# EAGLE design bldcmd_ver1 (EAGLE 8.6.1)

## Sheet 1 of 2
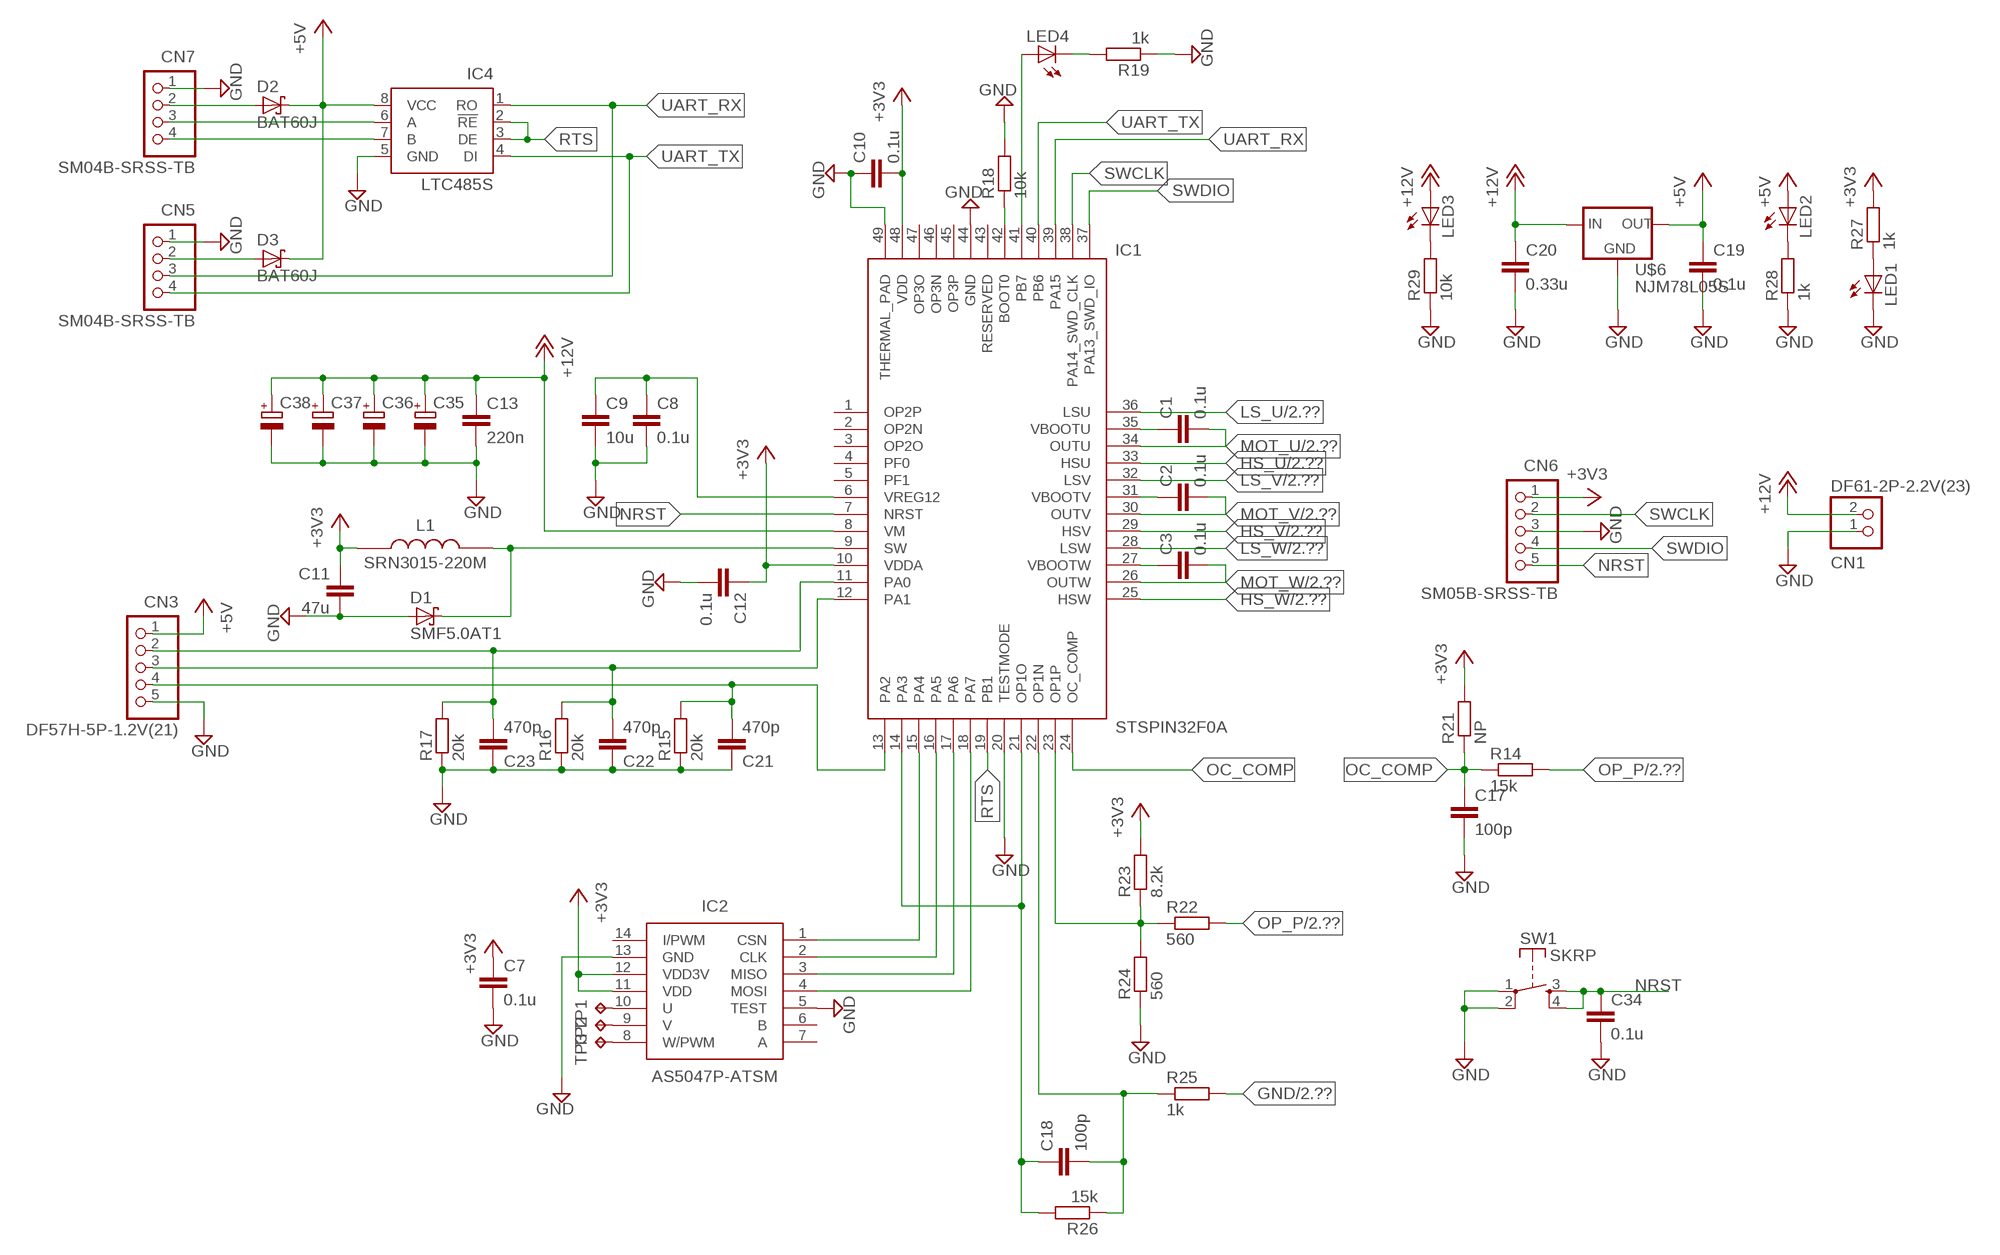
[diagram p0: schematic, sheet 1]

### Parts
C1  0.1u  C-EUC0402  [C0402]
C2  0.1u  C-EUC0402  [C0402]
C3  0.1u  C-EUC0402  [C0402]
C7  0.1u  C-EUC0603K  [C0603K]
C8  0.1u  C-EUC0603K  [C0603K]
C9  10u  C-EUC0805K  [C0805K]
C10  0.1u  C-EUC0603K  [C0603K]
C11  47u  C-EUC1206K  [C1206K]
C12  0.1u  C-EUC0603K  [C0603K]
C13  220n  C-EUC0805K  [C0805K]
C17  100p  C-EUC0402  [C0402]
C18  100p  C-EUC0402  [C0402]
C19  0.1u  C-EUC0603K  [C0603K]
C20  0.33u  C-EUC0805K  [C0805K]
C21  470p  C-EUC0402  [C0402]
C22  470p  C-EUC0402  [C0402]
C23  470p  C-EUC0402  [C0402]
C34  0.1u  C-EUC0603K  [C0603K]
C35  CPOL-EU153CLV-0605  [153CLV-0605]
C36  CPOL-EU153CLV-0605  [153CLV-0605]
C37  CPOL-EU153CLV-0605  [153CLV-0605]
C38  CPOL-EU153CLV-0605  [153CLV-0605]
CN1  DF61-2P-2.2V(23)  [DF61-2P-2.2V]
CN3  DF57H-5P-1.2V(21)  [DF57H-5P-1.2V(21)]
CN5  SM04B-SRSS-TB  [SM04B-SRSS-TB]
CN6  SM05B-SRSS-TB  [SM05B-SRSS-TB]
CN7  SM04B-SRSS-TB  [SM04B-SRSS-TB]
D1  SMF5.0AT1  [SOD123FL]
D2  BAT60J  [SOD323_ST]
D3  BAT60J  [SOD323_ST]
IC1  STSPIN32F0A  [VFQFPN48_7X7X1.0-48L]
IC2  AS5047P-ATSM  [SOP65P640X120-14N]
IC4  LTC485S  [SOIC8]
L1  SRN3015-220M  [SRN3015]
LED1  LEDSML0603  [SML0603]
LED2  LEDSML0603  [SML0603]
LED3  LEDSML0603  [SML0603]
LED4  LEDSML0603  [SML0603]
R14  15k  R-EU_R0402  [R0402]
R15  20k  R-EU_R0402  [R0402]
R16  20k  R-EU_R0402  [R0402]
R17  20k  R-EU_R0402  [R0402]
R18  10k  R-EU_R0402  [R0402]
R19  1k  R-EU_R0603  [R0603]
R21  NP  R-EU_R0402  [R0402]
R22  560  R-EU_R0402  [R0402]
R23  8.2k  R-EU_R0402  [R0402]
R24  560  R-EU_R0402  [R0402]
R25  1k  R-EU_R0402  [R0402]
R26  15k  R-EU_R0402  [R0402]
R27  1k  R-EU_R0603  [R0603]
R28  1k  R-EU_R0603  [R0603]
R29  10k  R-EU_R0603  [R0603]
SW1  SKRP  [SKRP]
TP1  TPTP08R  [TP08R]
TP2  TPTP08R  [TP08R]
TP3  TPTP08R  [TP08R]
U$6  NJM78L05S  [SOT89R]

### Nets
+3V3: C7.1 C10.2 C11.1 C12.1 CN6.1 IC1.10(VDDA) IC1.48(VDD) IC2.11(VDD) IC2.12(VDD3V) L1.1 R21.2 R23.2 R27.2
+5V: C19.1 CN3.1 D2.C D3.C IC4.8(VCC) LED2.A U$6.2(OUT)
+12V: C13.1 C20.1 C35.+ C36.+ C37.+ C38.+ CN1.2 IC1.8(VM) LED3.A U$6.1(IN) ; also sheet 2
GND: C7.2 C8.2 C9.2 C10.1 C11.2 C12.2 C13.2 C17.2 C19.2 C20.2 C21.1 C22.1 C23.1 C34.2 C35.- C36.- C37.- C38.- CN1.1 CN3.5 CN5.1 CN6.3 CN7.1 D1.A IC1.20(TESTMODE) IC1.44(GND) IC1.49(THERMAL_PAD) IC2.5(TEST) IC2.13(GND) IC4.5(GND) LED1.C R15.1 R16.1 R17.1 R18.2 R19.1 R24.1 R25.2 R28.1 R29.1 SW1.1 SW1.2 U$6.3(GND) U$6.4(GND) ; also sheet 2
HS_U: IC1.33(HSU) ; also sheet 2
HS_V: IC1.29(HSV) ; also sheet 2
HS_W: IC1.25(HSW) ; also sheet 2
LS_U: IC1.36(LSU) ; also sheet 2
LS_V: IC1.32(LSV) ; also sheet 2
LS_W: IC1.28(LSW) ; also sheet 2
MOT_U: C1.2 IC1.34(OUTU) ; also sheet 2
MOT_V: C2.2 IC1.30(OUTV) ; also sheet 2
MOT_W: C3.2 IC1.26(OUTW) ; also sheet 2
N$1: C3.1 IC1.27(VBOOTW)
N$2: IC2.10(U) TP1.TP
N$3: IC2.9(V) TP2.TP
N$4: C2.1 IC1.31(VBOOTV)
N$5: C1.1 IC1.35(VBOOTU)
N$6: IC2.8(W/PWM) TP3.TP
N$7: IC1.15(PA4) IC2.1(CSN)
N$8: IC1.16(PA5) IC2.2(CLK)
N$10: CN5.2 D3.A
N$12: IC1.17(PA6) IC2.3(MISO)
N$17: IC1.18(PA7) IC2.4(MOSI)
N$18: D1.C IC1.9(SW) L1.2
N$19: C8.1 C9.1 IC1.6(VREG12)
N$21: LED2.C R28.2
N$22: IC1.42(BOOT0) R18.1
N$23: C21.2 CN3.4 IC1.13(PA2) R15.2
N$24: C22.2 CN3.3 IC1.12(PA1) R16.2
N$25: C23.2 CN3.2 IC1.11(PA0) R17.2
N$26: IC1.23(OP1P) R22.1 R23.1 R24.2
N$27: C18.2 IC1.22(OP1N) R25.1 R26.1
N$28: C18.1 IC1.14(PA3) IC1.21(OP1O) R26.2
N$29: CN7.3 IC4.6(A)
N$30: CN7.2 D2.A
N$31: LED1.A R27.1
N$32: CN7.4 IC4.7(B)
N$33: LED4.C R19.2
N$34: LED3.C R29.2
N$37: IC1.41(PB7) LED4.A
NRST: C34.1 CN6.5 IC1.7(NRST) SW1.3 SW1.4
OC_COMP: C17.1 IC1.24(OC_COMP) R14.1 R21.1
OP_P: R14.2 R22.2 ; also sheet 2
RTS: IC1.19(PB1) IC4.2(!RE) IC4.3(DE)
SWCLK: CN6.2 IC1.38(PA14_SWD_CLK)
SWDIO: CN6.4 IC1.37(PA13_SWD_IO)
UART_RX: CN5.3 IC1.39(PA15) IC4.1(RO)
UART_TX: CN5.4 IC1.40(PB6) IC4.4(DI)
Unconnected: IC1.1(OP2P) IC1.2(OP2N) IC1.3(OP2O) IC1.4(PF0) IC1.5(PF1) IC1.43(RESERVED) IC1.45(OP3P) IC1.46(OP3N) IC1.47(OP3O) IC2.6(B) IC2.7(A) IC2.14(I/PWM)

## Sheet 2 of 2
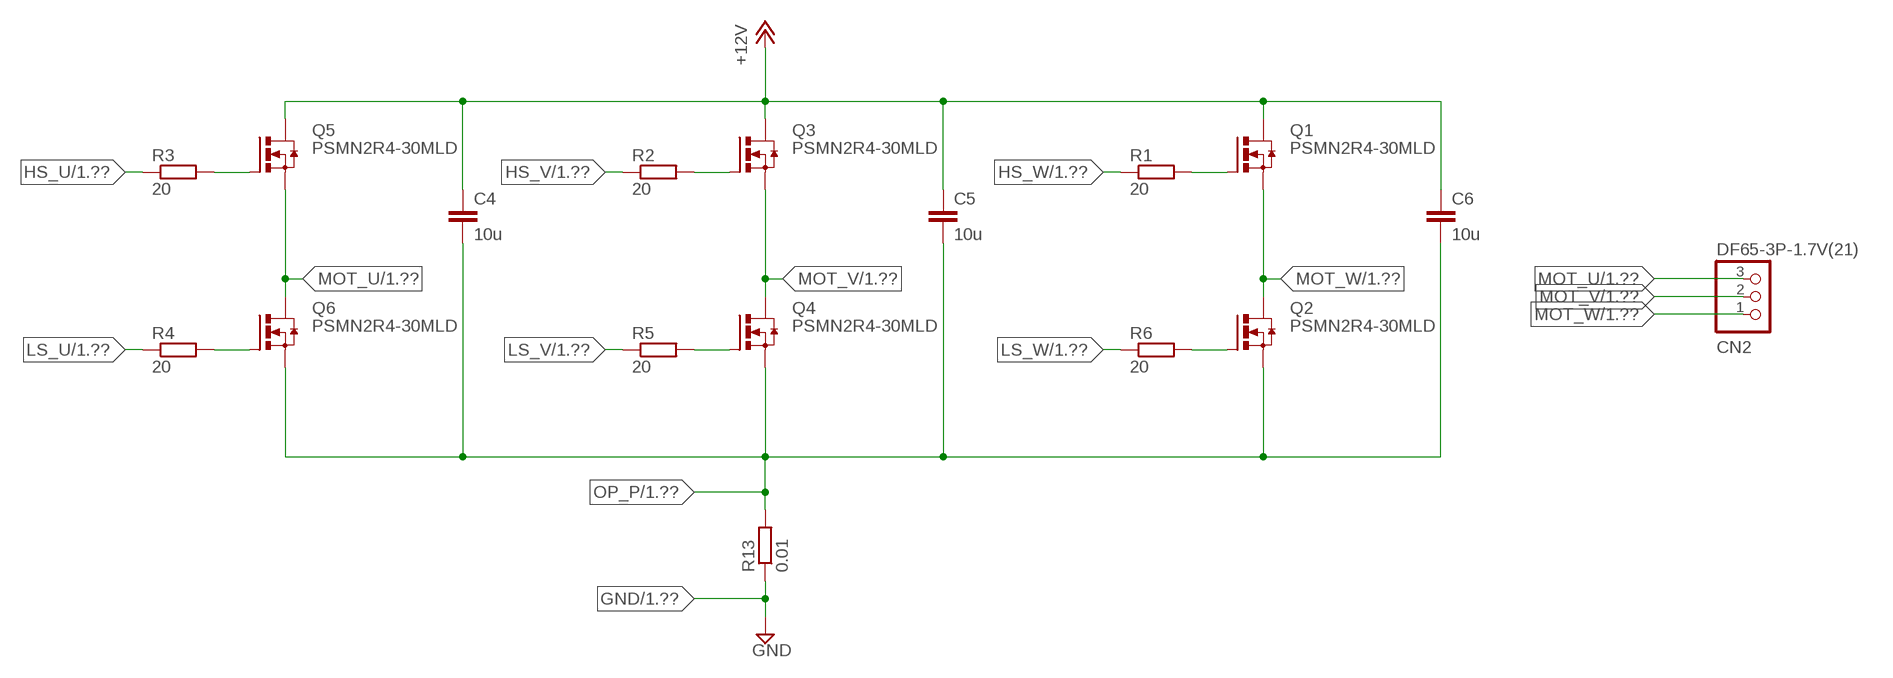
[diagram p1: schematic, sheet 2]

### Parts
C4  10u  C-EUC1206  [C1206]
C5  10u  C-EUC1206  [C1206]
C6  10u  C-EUC1206  [C1206]
CN2  DF65-3P-1.7V(21)  [DF65-3P-1.7V]
Q1  PSMN2R4-30MLD  [LFPAK33]
Q2  PSMN2R4-30MLD  [LFPAK33]
Q3  PSMN2R4-30MLD  [LFPAK33]
Q4  PSMN2R4-30MLD  [LFPAK33]
Q5  PSMN2R4-30MLD  [LFPAK33]
Q6  PSMN2R4-30MLD  [LFPAK33]
R1  20  R-EU_R0603  [R0603]
R2  20  R-EU_R0603  [R0603]
R3  20  R-EU_R0603  [R0603]
R4  20  R-EU_R0603  [R0603]
R5  20  R-EU_R0603  [R0603]
R6  20  R-EU_R0603  [R0603]
R13  0.01  R-EU_R3216  [R3216]

### Nets
+12V: C4.1 C5.1 C6.1 Q1.MB(D) Q3.MB(D) Q5.MB(D) ; also sheet 1
GND: R13.1 ; also sheet 1
HS_U: R3.1 ; also sheet 1
HS_V: R2.1 ; also sheet 1
HS_W: R1.1 ; also sheet 1
LS_U: R4.1 ; also sheet 1
LS_V: R5.1 ; also sheet 1
LS_W: R6.1 ; also sheet 1
MOT_U: CN2.3 Q5.1(S) Q5.2(S) Q5.3(S) Q6.MB(D) ; also sheet 1
MOT_V: CN2.2 Q3.1(S) Q3.2(S) Q3.3(S) Q4.MB(D) ; also sheet 1
MOT_W: CN2.1 Q1.1(S) Q1.2(S) Q1.3(S) Q2.MB(D) ; also sheet 1
N$9: Q1.4(G) R1.2
N$11: Q3.4(G) R2.2
N$13: Q5.4(G) R3.2
N$14: Q6.4(G) R4.2
N$15: Q4.4(G) R5.2
N$16: Q2.4(G) R6.2
OP_P: C4.2 C5.2 C6.2 Q2.1(S) Q2.2(S) Q2.3(S) Q4.1(S) Q4.2(S) Q4.3(S) Q6.1(S) Q6.2(S) Q6.3(S) R13.2 ; also sheet 1

## Library data of the parts
C1-C13 C17-C23 C34 = rcl:C-EU: CAPACITOR, European symbol
C35-C38 = rcl:CPOL-EU: POLARIZED CAPACITOR, European symbol; SPICEPREFIX: C
CN1 = scramble-con-hirose:DF61-2P-2.2V(23): Hirose DF61 Series, 2.2mm Pitch, 2 Way 1 Row Shrouded Straight PCB Header, Solder Termination <https://componentsearchengine.com/Images/3/DF61-2P-2.2V%2823%29.jpg> Source: Datasheet <https://www.hirose.com/product/download/?distributor=digikey&type=2d&lang=en&num=DF61-2P-2.2V(23)>; DESCRIPTION: Hirose DF61 Series, 2.2mm Pitch, 2 Way 1 Row Shrouded Straight PCB Header, Solder Termination; HEIGHT: mm; MANUFACTURER_NAME: Hirose; MANUFACTURER_PART_NUMBER: DF61-2P-2.2V(23); RS_PART_NUMBER: 7922837P; SUPPLIER_NAME: RS
CN2 = scramble-con-hirose:DF65-3P-1.7V(21): Hirose DF Series, Series Number 65, 1.7mm Pitch 3 Way 1 Row Straight PCB Header, Solder Termination, 4A <http://uk.rs-online.com/largeimages/R8735173-01.jpg> Source: Datasheet <http://www.mouser.com/ds/2/185/DF65_catalog-939162.pdf>; DESCRIPTION: Hirose DF Series, Series Number 65, 1.7mm Pitch 3 Way 1 Row Straight PCB Header, Solder Termination, 4A; HEIGHT: mm; MANUFACTURER_NAME: Hirose; MANUFACTURER_PART_NUMBER: DF65-3P-1.7V(21); RS_PART_NUMBER: 8735164; SUPPLIER_NAME: RS
CN3 = scramble-con-hirose:DF57H-5P-1.2V(21): HIROSE(HRS) - DF57H-5P-1.2V(21) - CONNECTOR, HEADER, 5POS, 1ROW, 1.2MM <https://componentsearchengine.com/Images/1/DF57H-5P-1.2V%2821%29.jpg> Source: Datasheet <https://www.hirose.com/product/en/download_file/key_name/DF57H-5P-1.2V(21)/category/Drawing (2D)/doc_file_id/45610/?file_category_id=6&item_id=06660107521&is_series=>; DESCRIPTION: HIROSE(HRS) - DF57H-5P-1.2V(21) - CONNECTOR, HEADER, 5POS, 1ROW, 1.2MM; HEIGHT: mm; MANUFACTURER_NAME: Hirose; MANUFACTURER_PART_NUMBER: DF57H-5P-1.2V(21); SUPPLIER_NAME: RS
CN5 CN7 = scramble-con-jst:?M04B-SRSS-TB: 4 way side entry SMT header,1mm pitch JST SH Series, 1mm Pitch 4 Way 1 Row Right Angle PCB Header, Solder Termination, 1A <https://componentsearchengine.com/Images/3/SM04B-SRSS-TB%28LFSN%29.jpg> Source: Datasheet <http://docs-europe.electrocomponents.com/webdocs/05b0/0900766b805b098a.pdf>
CN6 = scramble-con-jst:?M05B-SRSS-TB: JST SH Series, 1mm Pitch 5 Way 1 Row Right Angle PCB Header, Solder Termination, 1A <https://componentsearchengine.com/Images/3/SM05B-SRSS-TB+%28LF%29%28SN%29.jpg> Source: Datasheet <http://docs-europe.electrocomponents.com/webdocs/082f/0900766b8082f543.pdf>
D1 = diode:SMF5.0AT1: 200 W Transient Voltage Suppressor Source: Data sheet <http://www.onsemi.com/pub_link/Collateral/SMF5.0AT1-D.PDF>
D2 D3 = diode:BAT60J: Schottky barrier diode Source: www.st.com, BAT60J.pdf
IC1 = scramble-mcu:STSPIN32F0A: Advanced BLDC controller with embedded STM32 MCU Source: Datasheet <http://www.st.com/content/ccc/resource/technical/document/datasheet/group3/3d/88/0f/d1/3f/0c/49/80/DM00406030/files/DM00406030.pdf/jcr:content/translations/en.DM00406030.pdf>; DESCRIPTION: Advanced BLDC controller with embedded STM32 MCU; HEIGHT: 1mm; MANUFACTURER_NAME: STMicroelectronics; MANUFACTURER_PART_NUMBER: STSPIN32F0ATR; SUPPLIER_NAME: RS
IC2 = rcssl_lib:AS5047P-ATSM: Board Mount Hall Effect / Magnetic Sensors 14 bit core res Up to 28krpm <https://componentsearchengine.com/Images/1/AS5047P-ATSM.jpg> Source: Datasheet <http://ams.com/eng/content/download/725051/1853902/379375>; DESCRIPTION: Board Mount Hall Effect / Magnetic Sensors 14 bit core res Up to 28krpm; HEIGHT: 1.2mm; MANUFACTURER_NAME: ams; MANUFACTURER_PART_NUMBER: AS5047P-ATSM; SUPPLIER_NAME: RS
IC4 = linear-technology:LTC485: Low Power RS485 Interface Transceiver Source: http://www.linear.com/pc/downloadDocument.do?navId=H0,C1,C1007,C1017,P2064,D1718; OC_FARNELL: unknown; OC_NEWARK: unknown
L1 = scramble-mcu:SRN3015-220M: Power Inductor semi-shielded SMD 22uH Bourns SRN3015 Series Shielded Wire-wound SMD Inductor with a Ferrite Core, 22 H 20% Wire-Wound 600mA Idc <https://componentsearchengine.com/Images/1/SRN3015-220M.jpg> Source: Datasheet <http://www.farnell.com/datasheets/1875284.pdf>; DESCRIPTION: Power Inductor semi-shielded SMD 22uH Bourns SRN3015 Series Shielded Wire-wound SMD Inductor with a Ferrite Core, 22 H 20% Wire-Wound 600mA Idc; HEIGHT: mm; MANUFACTURER_NAME: Bourns; MANUFACTURER_PART_NUMBER: SRN3015-220M; RS_PART_NUMBER: 7435087; SUPPLIER_NAME: RS
LED1-LED4 = led:LED: LED OSRAM: - CHIPLED LG R971, LG N971, LY N971, LG Q971, LY Q971, LO R971, LY R971 LH N974, LH R974 LS Q976, LO Q976, LY Q976 LO Q996 - Hyper CHIPLED LW Q18S LB Q993, LB Q99A, LB R99A - SideLED LS A670, LO A670, LY A670, LG A670, LP A670 LB A673, LV A673, LT A673, LW A673 LH A674 LY A675 LS A676, LA A676, LO A676, LY A676, LW A676 LS A679, LY A679, LG A679 - Hyper Micro SIDELED® LS Y876, LA Y876, LO Y876, LY Y876 LT Y87S - SmartLED LW L88C, LW L88S LB L89C, LB L89S, LG L890 LS L89K, LO L89K, LY L89K LS L896, LA L896, LO L896, LY L896 - TOPLED LS T670, LO T670, LY T670, LG T670, LP T670 LSG T670, LSP T670, LSY T670, LOP T670, LYG T670 LG T671, LOG T671, LSG T671 LB T673, LV T673, LT T673, LW T673 LH T674 LS T676, LA T676, LO T676, LY T676, LB T676, LH T676, LSB T676, LW T676 LB T67C, LV T67C, LT T67C, LS T67K, LO T67K, LY T67K, LW E67C LS E67B, LA E67B, LO E67B, LY E67B, LB E67C, LV E67C, LT E67C LW T67C LS T679, LY T679, LG T679 LS T770, LO T770, LY T770, LG T770, LP T770 LB T773, LV T773, LT T773, LW T773 LH T774 LS E675, LA E675, LY E675, LS T675 LS T776, LA T776, LO T776, LY T776, LB T776 LHGB T686 LT T68C, LB T68C - Hyper Mini TOPLED® LB M676 - Mini TOPLED Santana® LG M470 LS M47K, LO M47K, LY M47K Source: http://www.osram.convergy.de LUXEON: - LUMILED® LXK2-PW12-R00, LXK2-PW12-S00, LXK2-PW14-U00, LXK2-PW14-V00 LXK2-PM12-R00, LXK2-PM12-S00, LXK2-PM14-U00 LXK2-PE12-Q00, LXK2-PE12-R00, LXK2-PE12-S00, LXK2-PE14-T00, LXK2-PE14-U00 LXK2-PB12-K00, LXK2-PB12-L00, LXK2-PB12-M00, LXK2-PB14-N00, LXK2-PB14-P00, LXK2-PB14-Q00 LXK2-PR12-L00, LXK2-PR12-M00, LXK2-PR14-Q00, LXK2-PR14-R00 LXK2-PD12-Q00, LXK2-PD12-R00, LXK2-PD12-S00 LXK2-PH12-R00, LXK2-PH12-S00 LXK2-PL12-P00, LXK2-PL12-Q00, LXK2-PL12-R00 Source: www.luxeon.com KINGBRIGHT: KA-3528ASYC Source: www.kingbright.com
Q1-Q6 = rcssl_lib:PSMN2R4-30MLD: N-channel 30 V 2.4 mΩ logic level MOSFET NextPower Technology Source: Data sheet <https://assets.nexperia.com/documents/data-sheet/PSMN2R4-30MLD.pdf> PSMN2R4-30MLD © Nexperia B.V. 2017. All rights reserved; MF: Nexperia USA Inc.; MPN: PSMN2R4-30MLD
R1-R6 R13-R19 R21-R29 = rcl:R-EU_: RESISTOR, European symbol
SW1 = 0_Yuki_Lib:SKRP
TP1-TP3 = testpad:TP: Test pad
U$6 = scramble-mcu:NJM78L?S

## Board
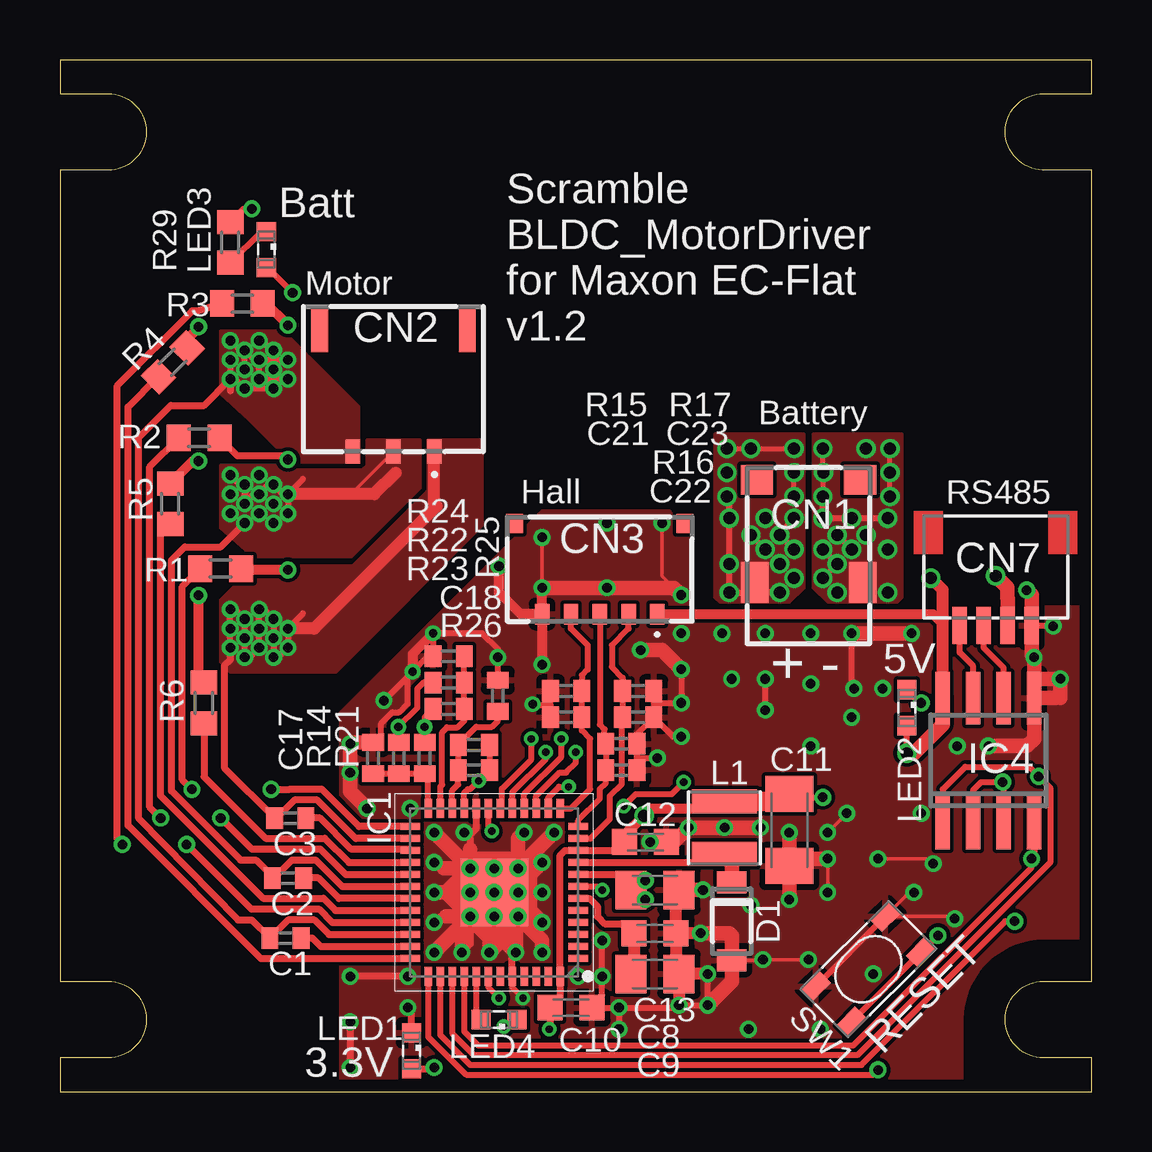
[diagram p2: board, top side]
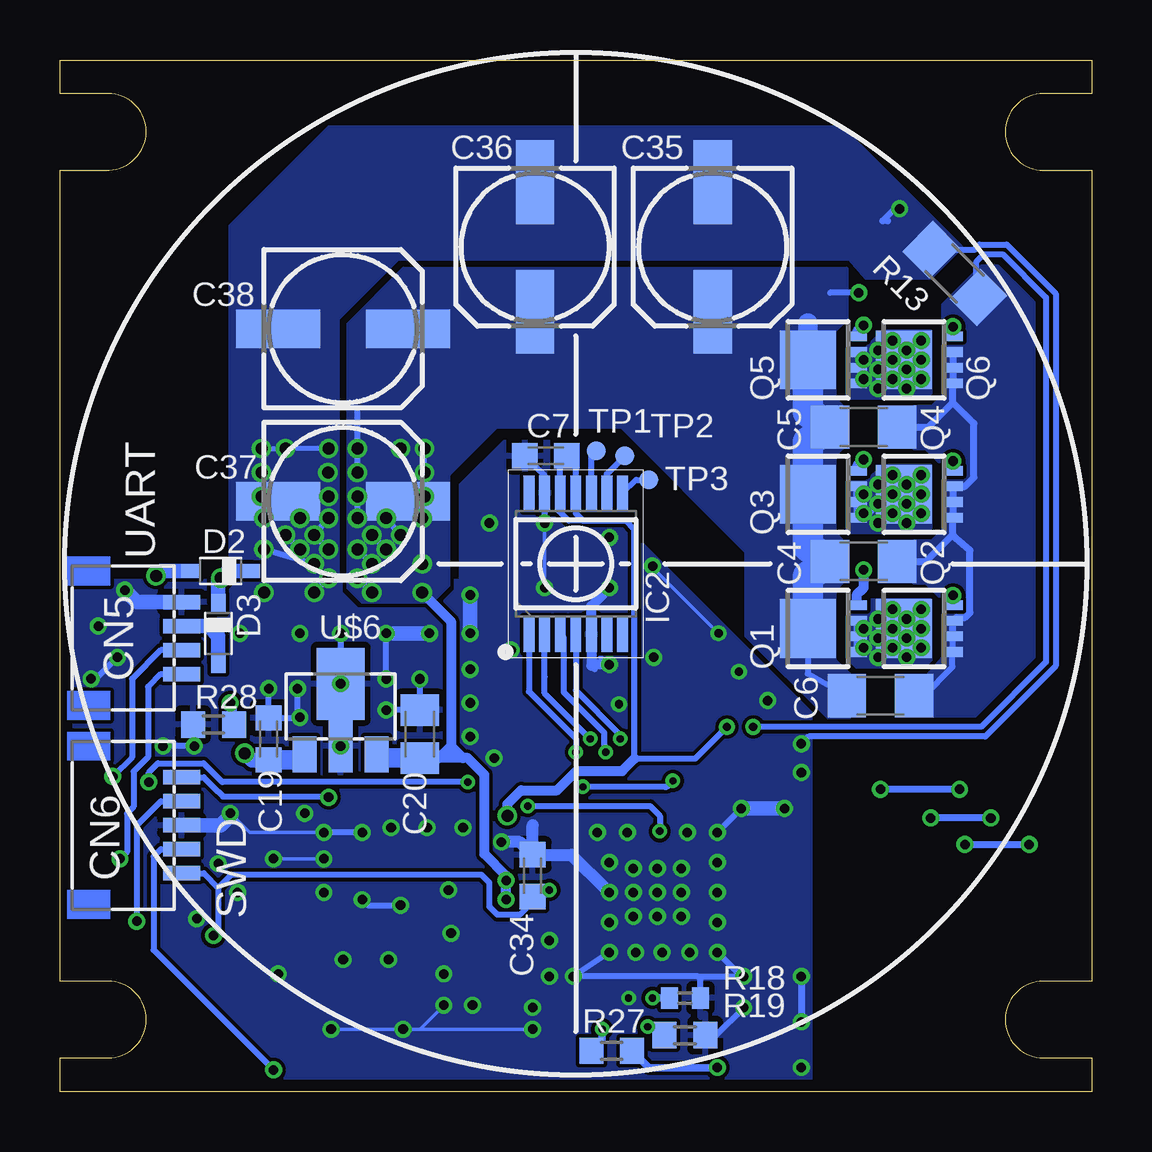
[diagram p3: board, bottom side, seen from below]

Size 43 x 43 mm. Coordinates in mm from the lower left corner, seen from the top.
Outline: 0,0 43,0 43,1.4 41,1.4 arc-90 39.4,3 arc-90 41,4.6 43,4.6 43,38.4 41.1,38.4 arc-90 39.4,40 arc-90 41,41.6 43,41.6 43,43 0,43 0,41.6 2,41.6 arc-90 3.6,40 arc-90 2,38.4 0,38.4 0,4.6 2,4.6 arc-90 3.6,3 arc-90 2,1.4 0,1.4 0,0
Copper layers (1*16): Top 0.035mm / dielectric 1.6mm / Bottom 0.035mm
Design rules "Elecrow_2-layer_PCB_eagle_rule": minimum track width 6mil, minimum drill 12mil, track to track 6mil, track to pad 6mil, pad to pad 6mil, via to via 8mil, smd to smd 0mil, copper to edge 20mil, drill to drill 10mil, minimum pad ring 6mil, minimum via ring 6mil, stop-mask expansion 0mil, vias tented up to drill 100mil, thermal gap 10mil

### Footprints (pad centres in the part's own frame; a part is rotated, then mirrored left to right if it is on the bottom)
C0402 = smd 0.7 x 0.9: 1 -0.65,0; 2 0.65,0
C1206 = smd 1.6 x 1.8: 1 -1.4,0; 2 1.4,0
C0603K = smd 1.05 x 1.08: 1 -0.875,0; 2 0.875,0
C0805K = smd 1.3 x 1.6: 1 -1,0; 2 1,0
C1206K = smd 1.5 x 2: 1 -1.5,0; 2 1.5,0
153CLV-0605 = smd 3.5 x 1.6: + 2.7,0; - -2.7,0
DF61-2P-2.2V = smd 1.15 x 1.7: 1 -2.25,1.68; 2 2.25,1.68 | smd 1.35 x 1.24: 3 -2.15,-2.6; 4 2.15,-2.6
DF65-3P-1.7V = smd 0.6 x 1: 1 -1.7,3.025; 2 0,3.025; 3 1.7,3.025 | smd 0.7 x 1.8: 4 -3.075,-2.025; 5 3.075,-2.025
DF57H-5P-1.2V(21) = smd 0.6 x 0.85: 1 -2.4,-0.3; 2 -1.2,-0.3; 3 0,-0.3; 4 1.2,-0.3; 5 2.4,-0.3 | smd 0.7 x 0.8: 6 3.55,-4.075; 7 -3.55,-4.075
SM04B-SRSS-TB = smd 0.6 x 1.55: 1 -1.5,2.275; 2 -0.5,2.275; 3 0.5,2.275; 4 1.5,2.275
SM05B-SRSS-TB = smd 0.6 x 1.55: 1 -2,2.275; 2 -1,2.275; 3 0,2.275; 4 1,2.275; 5 2,2.275
SOD123FL = smd 0.91 x 1.22: A 1.625,0; C -1.625,0
SOD323_ST = smd 0.8 x 0.6: A 1.25,0; C -1.25,0
VFQFPN48_7X7X1.0-48L = smd 0.8 x 0.3: 1 -3.5,2.75; 2 -3.5,2.25; 3 -3.5,1.75; 4 -3.5,1.25; 5 -3.5,0.75; 6 -3.5,0.25; 7 -3.5,-0.25; 8 -3.5,-0.75; 9 -3.5,-1.25; 10 -3.5,-1.75; 11 -3.5,-2.25; 12 -3.5,-2.75; 25 3.5,-2.75; 26 3.5,-2.25; 27 3.5,-1.75; 28 3.5,-1.25; 29 3.5,-0.75; 30 3.5,-0.25; 31 3.5,0.25; 32 3.5,0.75; 33 3.5,1.25; 34 3.5,1.75; 35 3.5,2.25; 36 3.5,2.75 | smd 0.3 x 0.8: 13 -2.75,-3.5; 14 -2.25,-3.5; 15 -1.75,-3.5; 16 -1.25,-3.5; 17 -0.75,-3.5; 18 -0.25,-3.5; 19 0.25,-3.5; 20 0.75,-3.5; 21 1.25,-3.5; 22 1.75,-3.5; 23 2.25,-3.5; 24 2.75,-3.5; 37 2.75,3.5; 38 2.25,3.5; 39 1.75,3.5; 40 1.25,3.5; 41 0.75,3.5; 42 0.25,3.5; 43 -0.25,3.5; 44 -0.75,3.5; 45 -1.25,3.5; 46 -1.75,3.5; 47 -2.25,3.5; 48 -2.75,3.5 | smd 2.8 x 2.8: 49 0,0
SOP65P640X120-14N = smd 1.475 x 0.45: 1 -2.938,1.95; 2 -2.938,1.3; 3 -2.938,0.65; 4 -2.938,0; 5 -2.938,-0.65; 6 -2.938,-1.3; 7 -2.938,-1.95; 8 2.938,-1.95; 9 2.938,-1.3; 10 2.938,-0.65; 11 2.938,0; 12 2.938,0.65; 13 2.938,1.3; 14 2.938,1.95
SOIC8 = smd 0.6 x 2.2: 1 -1.905,-2.6; 2 -0.635,-2.6; 3 0.635,-2.6; 4 1.905,-2.6; 5 1.905,2.6; 6 0.635,2.6; 7 -0.635,2.6; 8 -1.905,2.6
SRN3015 = smd 2.7 x 1: 1 0,-1.1; 2 0,1.1
SML0603 = smd 0.8 x 0.8: A 0.75,0; C -0.75,0
LFPAK33 = smd 0.4 x 0.8: 1 -0.975,-1.625; 2 -0.325,-1.625; 3 0.325,-1.625; 4 0.975,-1.625 | smd 2.45 x 2.35: MB 0,0.425
R0603 = smd 1 x 1.1: 1 -0.85,0; 2 0.85,0
R3216 = smd 1.6 x 1.8: 1 -1.4,0; 2 1.4,0
R0402 = smd 0.7 x 0.9: 1 -0.65,0; 2 0.65,0
SKRP = smd 1.1 x 0.7: 1 -2.05,1.05; 2 2.05,1.05; 3 -2.05,-1.05; 4 2.05,-1.05
TP08R = smd 0.8 x 0.8: TP 0,0
SOT89R = smd 1 x 1.5: 1 1.5,-1.75; 2 -1.5,-1.75 | smd 1 x 2.2: 3 0,-1.4 | smd 2 x 3: 4 0,1.2

### Placement (x,y rotation side)
C1  9.4,6.4 180 top
C2  9.5,8.9 180 top
C3  9.6,11.4 180 top
C4  9.5,22.1 0 bottom
C5  9.5,27.7 0 bottom
C6  8.8,16.5 0 bottom
C7  22.75,26.5 180 bottom
C8  24.8,6.6 0 top
C9  24.8,4.9 0 top
C10  21.3,3.5 180 top
C11  30.4,10.9 270 top
C12  24.4,10.4 0 top
C13  24.8,8.4 0 top
C17  13.05,13.9 90 top
C18  17.25,14.45 180 top
C19  34.3,14.7 90 bottom
C20  28,14.9 90 bottom
C21  21.1,15.6 0 top
C22  23.4,13.4 180 top
C23  24.1,15.6 180 top
C34  23.3,9 90 bottom
C35  15.8,35.2 270 bottom
C36  23.2,35.2 270 bottom
C37  31.2,24.6 0 bottom
C38  31.2,31.8 0 bottom
CN1  31.2,22.9 180 top
CN2  13.9,29.7 180 top
CN3  22.5,19.6 180 top
CN5  40.2,18.9 270 bottom
CN6  40.2,11.1 270 bottom
CN7  39,21.7 180 top
D1  28,7.1 270 top
D2  36.3,21.7 180 bottom
D3  36.4,19.1 270 bottom
IC1  18.1,8.3 180 top
IC2  21.5,22 90 bottom
IC4  38.7,13.8 0 top
L1  27.7,11 180 top
LED1  14.65,1.7 270 top
LED2  35.3,16 270 top
LED3  8.6,35.1 270 top
LED4  18.3,3 180 top
Q1  11.4,19.3 90 bottom
Q2  7.4,19.3 90 bottom
Q3  11.4,24.9 90 bottom
Q4  7.4,24.9 90 bottom
Q5  11.4,30.5 90 bottom
Q6  7.4,30.5 90 bottom
R1  6.7,21.8 0 top
R2  5.8,27.25 0 top
R3  7.6,32.85 0 top
R4  4.7,30.4 45 top
R5  4.6,24.5 90 top
R6  6,16.2 90 top
R13  5.7,34.1 315 bottom
R14  14.12,13.9 90 top
R15  21.1,16.7 0 top
R16  23.4,14.5 180 top
R17  24.1,16.7 180 top
R18  16.95,3.9 0 bottom
R19  16.95,2.35 180 bottom
R21  15.2,13.9 90 top
R22  16.2,17.05 180 top
R23  16.2,15.95 180 top
R24  16.2,18.15 0 top
R25  18.25,16.5 90 top
R26  17.25,13.4 0 top
R27  20,1.7 180 bottom
R28  36.6,15.3 0 bottom
R29  7.1,35.4 270 top
SW1  33.7,5.1 45 top
TP1  20.65,26.7 90 bottom
TP2  19.45,26.5 90 bottom
TP3  18.45,25.5 90 bottom
U$6  31.3,15.8 0 bottom

### Tracks (layer width: path | path; a pad name or v marks a point on that pad's centre or on a via)
+3V3  (via drill 0.3, 0.35, 0.4, 0.5)
  Top 0.254: R21.2 v15.2,15.2 15.2,15.6 R23.2 | C10.2 20.4,3.5 | C11.1 30.53,12.27 v31.8,12.27
  Top 0.3: 20.75,3.88 C10.2 | 23.58,10.43 23.48,10.32 23.2,10.05 IC1.10 21.05,10.05 20.85,9.85 IC1.48 20.85,3.92 C10.2 | C10.2 20.43,2.62 v20.4,2.6
  Top 0.305: C12.1 23.58,10.43
  Top 0.406: 23.48,10.32 23.48,10.68 v24.35,11.5 24.6,11.8 27.4,11.8 L1.1
  Top 0.813: L1.1 30.1,12.1 C11.1
  Bottom 0.254: 21.44,24.88 IC2.11 | 19.05,13.88 19.05,23.41 19.43,23.8 21.2,23.8 | 19.05,13.88 16.52,13.88 v15.2,15.2 | 19.64,13.28 19.05,13.88 | IC2.11 21.5,24.1 21.2,23.8 | IC2.11 21.5,26.12 C7.1 22.15,26.23 IC2.12 22.15,24.25 22.2,24.2 21.8,23.8 21.2,23.8 | CN6.1 37.01,13.1 36.4,12.49 36.39,12.49 36.2,12.3 31.83,12.3 v31.8,12.27
  Bottom 0.305: R27.2 20.4,2.15 v20.4,2.6
  Bottom 0.406: v24.35,11.5 24.35,11.98 23.77,12.56 22.27,12.56 21.47,13.36 19.57,13.36 19.05,13.88
+5V  (via drill 0.5)
  Top 0.254: v35.3,14.1 LED2.A
  Top 0.406: 24.98,19.98 CN3.1 36.39,19.9 36.79,19.5
  Top 0.508: IC4.8 36.8,18.48 36.79,18.48 36.79,19.5 36.79,20.91 v36.3,21.4
  Top 0.61: 36.8,16.5 IC4.8 36.8,15.29 35.6,14.1 v35.3,14.1
  Bottom 0.508: 34.33,13.8 C19.1
  Bottom 0.61: D3.C 36.4,21.3 v36.3,21.4 36,21.7 D2.C | v35.3,14.1 35,13.8 34.33,13.8
  Bottom 0.813: U$6.2 33.02,13.82 C19.1
+12V  (via drill 0.4, 0.5)
  Top 0.203: v27.8,26.8 v28.8,26.8 v30.6,26.8 | v30.6,24.8 v30.6,25.8
  Top 0.254: v30.6,22.6 v30,23.2 v30.6,23.9 | v29.4,22.6 v28.8,23.2 | v27.8,24.8 27.9,24.7 v27.9,23.9 v27.9,22 v27.9,20.8 29.1,20.8 | v30,20.8 29.1,20.8 | 29.1,20.8 29,20.7 28.95,20.75 CN1.2 | v9.7,33.3 8.65,34.35 LED3.A
  Top 0.3: C13.1 23.15,9.05 IC1.8
  Top 0.406: C13.1 24,8.4 v24.4,8.8
  Bottom 0.203: v27.8,24.8 v27.8,25.8 v27.8,26.8
  Bottom 0.254: Q1.MB 11.82,17.43 C6.1 | v30,22 v30.6,22.6 | v30,23.2 v29.4,22.6 | v28.8,23.2 v29.4,23.9 | v30.6,23.9 v30.6,24.8 | v30.6,25.8 v30.6,26.8 30.6,28.4 | v30,20.8 v30.6,21.4 | v9.7,33.3 10.9,33.3
  Bottom 0.406: v24.4,8 v24.4,8.8 24.4,8.99 25.31,9.9 25.31,13.21 26,13.9 26.2,13.9 | v27.9,20.8 26.7,19.6 26.7,14.4 | 27.3,13.9 C20.1 27.2,13.9 | 26.2,13.9 27.2,13.9 | 26.7,14.4 27.2,13.9 | 26.7,14.4 26.2,13.9
  Bottom 0.813: Q5.MB 11.82,32.02 | C20.1 29.65,13.9 U$6.1
  Bottom 1.27: Q5.MB 11.82,28.32 C5.1 11.82,27.07 Q3.MB 11.82,22.73 C4.1 11.82,21.48 Q1.MB
  pour Bottom (no thermals): 10.7,31.7 10.7,28.9 10.4,28.6 10.4,26.8 10.7,26.5 10.7,23.3 10.4,23 10.4,21.2 10.7,20.9 10.7,18 10.1,17.4 10.1,15.6 11,15.6 14.4,19 14.4,22.5 19.6,27.7 24.8,27.7 26.8,25.7 26.8,21.1 27.5,20.4 30.4,20.4 31,21 31,32 28.7,34.3 10.2,34.3 10.2,32.2
  pour Top (no thermals): 31,21 31,27.4 27.3,27.4 27.3,20.6 27.5,20.4 30.4,20.4
GND  (via drill 0.3, 0.35, 0.4, 0.5)
  Top 0.152: v25.9,20.7 25.1,21.5 v25.1,23.7 | v37.3,7.2 37.21,7.29 SW1.2 35.41,8.3 v35.6,8.3 | v34.1,9.7 36.2,9.7 v36.4,9.5 | D1.A 29.27,5.47 v29.3,5.5 v31.2,5.5 | v32,10.8 v32.8,11.6 | v32,9.7 v32,8.3 | v20.1,21 v20.1,23.1
  Top 0.203: v34.6,24.8 v34.6,25.8 v34.6,26.8 | v31.8,24.8 31.83,24.83 v31.83,25.8 31.8,25.83 v31.8,26.8
  Top 0.254: v22.6,4.8 v21.6,4.8 | v22.6,4.8 v22.6,6.3 | IC1.44 18.85,4.35 v19.3,3.9 | v22.6,4.8 22.6,4.03 C10.1 v23.3,3.5 | v14.7,17.5 15.35,18.15 R24.1 v15.55,19.1 17.6,19.1 18.25,18.45 v18.25,18.1 R25.2 18.45,17.35 | C21.1 R15.1 | R17.1 24.75,16.2 | 24.75,16.2 C23.1 | C22.1 24.05,14 | 24.05,14 R16.1 24.05,14.9 C23.1 | v14.7,17.5 14.49,17.29 14.49,16.17 14.13,15.81 13.85,15.81 13.4,15.35 13.4,14.9 C17.2 | v23.3,3.5 v23.3,2.6 | v27,4.9 v27,3.6 v25.8,3.6 25.7,3.5 v23.3,3.5 | 24.05,14 24.15,13.9 v24.9,13.9 | C23.1 25.55,14.8 v25.9,14.8 | 24.75,16.2 v25.9,16.2 v25.9,17.6 25.7,17.8 | v14.7,17.5 v13.5,16.3 | v40.6,18.1 40.6,18.91 | 20.45,16.1 19.75,16.1 v19.7,16.15 | v31.8,21.4 v32.4,22 v31.8,22.6 | v32.4,23.2 v33,22.6 | v31.8,24.8 v31.8,23.9 v33,23.9 v34.5,23.9 | SW1.1 SW1.2 | CN3.5 20.1,19.3 | v29.4,15.9 v29.4,17.2 | v33.1,16.8 33,16.9 v33,19.1 | CN7.1 41.38,19.43 v41.4,19.4 | v12.1,13.3 v12.1,14.49 | R29.1 7.65,36.8 v8,36.8
  Top 0.3: IC1.49 18.85,7.55 | 17.35,9.05 IC1.49 | v19.1,7.3 19.1,7.2 19.2,7.3 | 17.1,9.5 17,9.4 v17.1,9.3 v19.1,9.3 arc-90 IC1.49 | v20.1,8.3 20.1,8.2 | LED1.C 14.65,3.35 v14.5,3.5 | v14.5,4.8 v12.1,4.8 | v12.1,2.9 v12.1,1 | IC1.44 18.85,5.65 v19,5.8 | v15.6,9.55 15.85,9.3 16,9.3 | v15.6,7.05 15.85,7.3 16.1,7.3 | v16.85,10.8 17.02,10.62 | 17.02,10.62 17.1,10.55 17.1,10.1 | v16.75,5.8 17.1,6.15 17.1,7.2 v17.1,7.3 18.6,7.3 v19.1,7.3 | 19.7,9.3 19.85,9.3 v20.1,9.55 | v19.1,7.3 19.85,7.3 v20.1,7.05 | IC1.20 17.35,10.95 17.02,10.62
  Top 0.406: C12.2 v24.6,10.4 | CN3.5 v20.1,21 | CN3.5 v20.1,17.8 | CN3.5 19.2,19.9 18.3,20.8 v18.3,21.9 | v15.55,19.1 14.7,18.25 v14.7,17.5
  Top 0.508: C8.2 25.68,5.03 C9.2 | C8.2 25.68,8.28 C13.2 | v26.7,6.6 C8.2 | v27,4.9 C9.2 | C9.2 v25.8,3.6
  Top 0.61: C12.2 25.6,10.4 v26.2,11 v27.7,11 v29.2,11 | C13.2 v26.8,8.4 | v26.7,6.6 27.9,6.6 28,6.5 D1.A 28,4.6 v27,3.6 | IC4.5 40.6,17.3 | 40.6,17.3 v40.6,18.1 40.5,18.2 CN7.1 40.5,20.7 v40.3,20.9 | IC4.5 40.6,14.71 40.3,14.4 v38.7,14.4 | v33,19.1 v35.5,19.1 | C11.2 v30.4,10.8 | C11.2 30.7,9.7 v32,9.7 | C11.2 v30.4,8 | v20.1,21 v22.8,21 25.6,21 v25.9,20.7 | v25.9,17.6 25.1,18.4 v24.2,18.4 | C17.2 12.16,14.55 v12.1,14.49 v12.1,13.3 12.1,12.51 v12.8,11.8 | v17.1,8.3 v15.6,8.3 16.1,8.3 | IC1.49 19.6,8.3 | 19.6,8.3 v20.1,8.3 | v19.1,9.3 v20.6,10.8 | v15.6,5.8 v17.1,7.3 | IC1.49 18.1,6.4 18.2,6.3 18.2,6.1 v17.9,5.8 17.9,6.4 17.1,7.2 | v20.1,5.8 20.1,6.3 v19.1,7.3 19,7.2 | v15.6,10.8 16.7,9.7 | 16.7,9.7 v17.1,9.3 | 19,7.2 v19,5.8 18.6,6.2 18.6,7.3 | 19,7.2 19.15,7.05 v20.1,7.05 19.6,7.55 19.6,8.3 | v17.1,7.3 16.75,6.95 v16.75,5.8 | IC1.49 v17.1,7.3 | v17.1,7.3 16.1,7.3 | v17.1,9.3 17.1,10.1 | IC1.49 v17.1,9.3 | v17.1,9.3 16,9.3 | IC1.49 v19.1,9.3 | v19.1,9.3 19.7,9.3 | v19.35,10.8 19.1,10.55 v19.1,9.3 | 19.6,8.3 19.6,9.05 v20.1,9.55 19.95,9.7 16.7,9.7 | 16.1,8.3 v17.1,9.3 | 16.1,8.3 v17.1,7.3 | IC4.5 41.5,16.4 41.6,16.5 41.7,16.4 v41.7,17.2 40.7,17.2 40.6,17.3
  Bottom 0.152: v22.8,23.7 v22.8,21 | v15.55,19.1 18.3,21.85 v18.3,21.9 | v23.3,2.6 v28.7,2.6 | v28.7,2.6 v31.7,2.6 | v32,10.8 35.1,10.8 35.85,11.55 v35.9,11.6 | v27,3.6 28,2.6 v28.7,2.6 | v32,9.7 v34.1,9.7 | U$6.4 U$6.3 | 20.52,18.1 20.4,18.1 v20.1,17.8 | IC2.5 20.85,18.43 | C37.- 34.1,24.8 v34.6,24.8
  Bottom 0.203: v34.6,26.8 v33.6,26.8 v31.8,26.8
  Bottom 0.254: v20.1,5.8 v21.6,4.8 16.4,4.8 | 16.4,4.8 16.2,4.8 | 16.2,4.8 v14.5,4.8 14.6,4.8 v15.6,5.8 | 20.2,8.4 v20.1,8.3 | 16.35,4.75 16.4,4.8 | v12.1,14.49 11.8,14.79 4.43,14.79 1.49,17.73 1.49,33.27 3.53,35.31 4.67,35.31 4.88,35.09 R13.1 6.59,35.09 6.3,34.8 | 20.85,17.75 20.7,17.6 | v15.6,10.8 v14.6,11.8 | v22.8,23.7 IC2.13 22.8,25.68 C7.2 | v15.55,19.1 15.6,19.1 | v32.4,20.8 v31.8,21.4 | v31.8,22.6 v32.4,23.2 v31.8,23.9 | v33,22.6 v33.6,23.2 | v32.4,22 v34.5,22.6 | v34.3,16.8 C19.2 33.02,15.57 v33,15.6 33.1,15.7 v33.1,16.8 | v29.4,15.9 C20.2 v28,17.2 | v29.4,17.2 v29.4,19.1 | v31.3,19.1 U$6.4 | v30.4,10.8 v32,10.8 | v30.4,8 30.16,7.76 v28.8,7.76 | R28.1 37.45,14.45 v37.4,14.4 v38.7,14.4 | v40.6,18.1 41.5,17.2 v41.7,17.2 | v8,36.8 8.2,36.8 8.7,36.3 | R18.2 16.3,4.7 16.2,4.8 | R19.1 15.65,2.35 v14.5,3.5
  Bottom 0.3: v12.1,4.8 v12.1,2.9 | 8.5,36.3 8.7,36.3
  Bottom 0.406: v20.1,17.8 20.8,17.8 20.85,17.75 IC2.5 20.85,20.25 v20.1,21
  Bottom 0.508: C34.2 21.68,9.88 20.2,8.4 | C34.2 23.3,11.1 | C34.2 23.82,10.4 v24.6,10.4
  Bottom 0.61: CN5.1 39.8,20.4 v40.3,20.9 | v29.4,19.1 v27.6,19.1 | v25.9,20.7 v25.9,19.1 | CN6.3 36.3,11.1 35.85,11.55 | v14.6,11.8 v12.8,11.8
  other vias: 18.1,8.3 19.1,8.3 18.1,9.3 18.1,7.3 34.5,20.8 31.3,17 33.9,4.9 31.3,14.4
  pour Bottom (no thermals): 9.4,33.9 10.1,34.7 28.9,34.7 31.4,32.2 31.4,20.4 35.9,20.4 35.9,36.1 31.8,40.2 10.4,40.2 5.4,35.2 6.7,33.9
  pour Bottom (rank 6): 43,6.4 43,21.3 26.3,21.3 26.3,25.3 24.5,27.1 19.4,27.1 18.8,26.5 18.8,22.9 11.7,15.8 11.7,0 37.6,0 37.6,3 arc-90 41,6.4
  pour Top (rank 6): 43,20.2 26.3,20.2 26.3,23.1 25.4,24.2 20.1,24.2 11.7,15.8 11.7,0 37.6,0 37.6,3 arc-90 41,6.4 43,6.4
  pour Top (no thermals): 31.4,21 31.4,27.4 35.1,27.4 35.1,20.6 34.9,20.4 32,20.4
HS_U  (via drill 0.4)
  Top 0.3: IC1.33 11.35,7.05 10.79,7.61 7.97,7.61 v5.28,10.3 | v2.6,10.3 2.39,10.51 2.39,29.42 5.5,32.53 5.74,32.53 R3.1
  Bottom 0.3: v5.28,10.3 v2.6,10.3
HS_V  (via drill 0.4)
  Top 0.3: IC1.29 11.91,9.05 10.85,10.11 8,10.11 v6.7,11.4 | v4.2,11.4 3.74,11.85 3.74,26.04 R2.1
  Bottom 0.3: v4.2,11.4 v6.7,11.4
HS_W  (via drill 0.4)
  Top 0.3: IC1.25 12.47,11.05 10.91,12.61 9.59,12.61 9.58,12.6 v8.8,12.6 | v5.5,12.6 5.1,13 5.1,21.05 R1.1
  Bottom 0.3: v5.5,12.6 v8.8,12.6
LS_U
  Top 0.3: IC1.36 8.37,5.55 2.84,11.08 2.84,28.54 R4.1
LS_V
  Top 0.3: IC1.32 11.49,7.55 10.98,8.06 8.46,8.06 4.2,12.33 4.2,23.25 R5.1
LS_W
  Top 0.3: IC1.28 12.05,9.55 11.04,10.56 8.56,10.56 6,13.12 R6.1
MOT_U  (via drill 0.4)
  Top 0.254: 8.9,30.8 v8.9,30.1 8.9,30 | 8.9,30.8 v8.9,30.9 | 8.9,30 v8.9,29.3 v7.7,29.3 7.3,29.7 v7.1,29.7 v7.1,30.5 | 8.9,30 8.6,29.7 v8.3,29.7 v8.3,30.5 8.1,30.5 v7.7,30.9 | v8.3,31.3 8.4,31.3 8.9,30.8 | v7.7,30.9 7.5,30.9 v7.1,31.3 | v7.7,30.1 v7.7,30.9
  Top 0.3: 7.1,29.2 v7.1,29.7 6,28.6 4.62,28.6 3.29,27.27 3.29,11.38 7.42,7.15 8,7.15 C1.2 | IC1.34 11.21,6.55 10.61,7.15 9.5,7.15 C1.2 | 8.87,6.4 C1.2 | v8.9,29.3 v8.9,30.1 | v8.3,29.7 v9.5,29.7 | v8.3,30.5 v9.5,30.5
  Bottom 0.3: Q5.2 9.78,30.23 v9.5,30.5
  pour Bottom (no thermals): 10.2,28.9 10.2,31 9.4,31 8.7,31.7 6.7,31.7 6.7,29.1 6.9,28.9
  pour Top (no thermals): 6.7,31.7 9.3,31.7 12.45,28.55 12.45,26.25 9.65,26.25 7.9,28 6.7,29.1
MOT_V  (via drill 0.4)
  Top 0.152: CN2.2 12.22,25 9.6,25
  Top 0.254: v9.5,24.1 v9.5,24.9 9.6,25 10.13,25.53
  Top 0.3: v9.5,24.9 9.3,24.9 v8.9,25.3 8.7,25.3 v8.3,24.9 8.1,24.9 v7.7,24.5 v7.7,25.3 7.5,25.3 v7.1,25.7 | IC1.30 11.77,8.55 10.67,9.65 9.68,9.65 8.92,8.9 | C2.2 8.92,8.9 | 8.92,8.9 8.17,9.65 7.52,9.65 4.65,12.53 4.65,22.15 5.2,22.7 6.7,22.7 v7.7,23.7
  Top 0.508: 14,25.8 13.1,24.9 v9.5,24.9
  Bottom 0.3: Q3.1 Q3.2 Q3.3 9.78,25.18 v9.5,24.9 | Q3.1 9.68,23.93 v9.5,24.1 | Q3.1 9.47,23.93 v8.9,24.5 8.5,24.9 | Q4.MB 7.83,24.77 v8.9,23.7 | 8.5,24.9 v8.3,24.9 Q4.MB | 8.5,24.9 v8.9,25.3 | Q4.MB 7.83,24.57 v8.3,24.1 | Q4.MB 7.83,23.82 v7.7,23.7 | Q4.MB 7.83,24.82 v7.1,24.1 | Q4.MB 7.83,25.18 v7.7,25.3 | Q4.MB v7.1,24.9 | Q4.MB 7.83,25.23 v8.3,25.7
  pour Bottom (no thermals): 10.2,23.3 6.9,23.3 6.7,23.5 6.7,26.1 8.7,26.1 9.4,25.4 10.2,25.4
  pour Top (no thermals): 6.7,26.1 9,26.1 9.2,25.9 12.6,25.9 12.8,26.1 12.8,27.15 15,27.15 15,25.15 12.15,22.3 8.05,22.3 6.7,23.5
MOT_W  (via drill 0.4)
  Top 0.254: v7.1,18.5 v7.1,19.3 v7.1,20.1 7.3,20.1 v7.7,19.7 v7.7,18.9 v7.7,18.1 7.9,18.1 v8.3,18.5 v8.3,19.3 v8.3,20.1 8.5,20.1 v8.9,19.7 v8.9,18.9 v8.9,18.1 9.1,18.1 v9.5,18.5 9.5,19.2 v9.5,19.3 10.13,19.93
  Top 0.3: v7.1,18.5 7.1,18 6.85,17.75 6.85,13.5 C3.2 9.02,11.4 9.78,12.15 10.72,12.15 12.33,10.55 IC1.26
  Top 0.508: 9.5,19.2 9.6,19.3 10.6,19.3 15.7,24.4 15.6,24.5 CN2.1
  Bottom 0.254: Q1.1 Q1.2 Q1.3 9.78,19.57 v9.5,19.3
  pour Bottom (no thermals): 10.2,18.1 9.8,17.7 7,17.7 6.7,18 6.7,20.5 9.5,20.5 10.2,19.8
  pour Top (no thermals): 6.7,20.5 8.1,21.9 12.2,21.9 15.35,25.05 15.35,27.15 17.6,27.15 17.6,23.6 11.5,17.5 7.1,17.5 6.7,17.9
N$1
  Top 0.3: C3.1 10.84,11.4 12.14,10.1 14.55,10.1 IC1.27
N$2
  Bottom 0.254: IC2.10 20.85,26.5 TP1.TP
N$3
  Bottom 0.254: IC2.9 20.2,25.75 TP2.TP
N$4
  Top 0.3: C2.1 10.78,8.9 11.63,8.05 IC1.31
N$5
  Top 0.3: C1.1 10.52,6.4 10.87,6.05 IC1.35
N$6
  Bottom 0.254: IC2.8 18.99,25.5 TP3.TP
N$7  (via drill 0.3)
  Top 0.254: IC1.15 19.85,12.32 20.82,13.3 21.1,13.3 21.5,13.7 v21.5,14.15
  Bottom 0.254: IC2.1 23.45,16.68 21.5,14.72 v21.5,14.15
N$8  (via drill 0.3)
  Top 0.254: IC1.16 19.35,12.4 20.9,13.95 v20.9,14.7
  Bottom 0.254: IC2.2 22.8,17.3 22.8,16.6 v20.9,14.7
N$9  (via drill 0.4)
  Top 0.406: v9.5,21.75 7.61,21.75 R1.2
  Bottom 0.406: Q1.4 9.78,20.73 9.5,21 v9.5,21.75
N$10
  Bottom 0.61: CN5.2 36.8,19.4 36.4,19 D3.A
N$11  (via drill 0.4)
  Top 0.3: v9.5,26.34 9.35,26.5 7.4,26.5 R2.2
  Bottom 0.406: Q3.4 9.78,26.07 v9.5,26.34
N$12  (via drill 0.3)
  Top 0.254: IC1.17 18.85,12.47 20.25,13.87 v20.25,14.15
  Bottom 0.254: v20.25,14.15 20.32,14.22 20.32,14.97 22,16.65 22,18.92 IC2.3
N$13  (via drill 0.4)
  Top 0.406: v9.5,31.95 8.49,32.95 R3.2
  Bottom 0.406: Q5.4 9.78,31.67 v9.5,31.95
N$14  (via drill 0.4)
  Top 0.406: v5.78,31.88 5.8,31.86 5.3,31.36 R4.2
  Bottom 0.406: Q6.4 v5.78,31.88
N$15  (via drill 0.4)
  Top 0.406: R5.2 5.53,26.28 v5.78,26.28
  Bottom 0.406: Q4.4 v5.78,26.28
N$16  (via drill 0.4)
  Top 0.406: R6.2 5.78,17.05 v5.78,20.68
  Bottom 0.406: Q2.4 v5.78,20.68
N$17  (via drill 0.3)
  Top 0.254: IC1.18 18.42,11.87 18.42,12.62 19.65,13.85 v19.65,14.7
  Bottom 0.254: IC2.4 21.5,16.72 19.65,14.87 v19.65,14.7
N$18
  Top 0.3: IC1.9 27.35,9.55 27.65,9.85 L1.2
  Top 0.508: 28.8,9.9 L1.2
  Top 0.61: D1.C 28,9.5 27.65,9.85
N$19
  Top 0.3: IC1.6 22.08,8.05 22.4,7.72 22.4,7.3 22.7,7 23.4,7 23.93,6.47 C8.1
  Top 0.508: C8.1 23.93,5.03 C9.1
N$21  (via drill 0.4)
  Top 0.254: LED2.C 35.85,16.2 v35.9,16.2
  Bottom 0.254: R28.2 35.75,16.05 v35.9,16.2
N$22  (via drill 0.3)
  Top 0.254: IC1.42 17.85,4.35 v18.3,3.9
  Bottom 0.305: R18.1 v18.3,3.9
N$23
  Top 0.254: IC1.13 21.3,11.8 22.1,12.6 22.1,14.7 21.75,15.05 C21.2 R15.2 21.75,17.35 21.99,17.59 21.99,18.61 21.3,19.3 CN3.4
N$24
  Top 0.254: 21.6,11.03 IC1.12 21.6,11.3 22.51,12.21 22.51,12.61 22.75,12.85 C22.2 R16.2 22.7,14.55 22.7,15.1 22.5,15.3 CN3.3
N$25
  Top 0.254: IC1.11 22.11,10.55 | 22.11,10.55 22.12,10.55 | 22.11,10.55 22.91,11.35 22.91,11.8 22.91,12.31 23.42,12.82 23.42,15.57 C23.2 R17.2 23.45,17.25 23,17.7 23,18.6 23.7,19.3 CN3.2
N$26
  Top 0.254: IC1.23 15.85,12.71 15.93,12.78 15.93,14.97 16.13,15.18 16.58,15.18 16.85,15.45 R23.1 R22.1 R24.2
N$27
  Top 0.254: IC1.22 16.35,12.55 16.6,12.8 R26.1 C18.2 17.35,15.2 18,15.2 18.25,15.45 R25.1
N$28  (via drill 0.3)
  Top 0.254: IC1.14 20.35,12.25 20.8,12.7 v21.2,12.7 | IC1.21 16.85,12.45 17,12.6 17.1,12.6 v17.45,12.95 17.6,13.1 17.9,13.1 R26.2 C18.1
  Bottom 0.254: 20.7,12.7 v21.2,12.7 18,12.7 17.8,12.7 17.7,12.7 v17.45,12.95
N$29
  Top 0.254: IC4.6 39.34,17.66 38.5,18.5 CN7.3
N$30  (via drill 0.5)
  Top 0.61: CN7.2 39.5,20.55 39.49,20.57 39.49,21.01 v39,21.5
  Bottom 0.61: D2.A 38.8,21.7 v39,21.5
N$31  (via drill 0.4)
  Top 0.3: LED1.A 15.55,0.95 v15.6,1
  Bottom 0.305: R27.1 18.45,1 v15.6,1
N$32
  Top 0.254: IC4.7 38.06,17.73 37.5,18.3 CN7.4
N$33  (via drill 0.3)
  Top 0.254: v18.5,2.7 18.75,2.7 LED4.C
  Bottom 0.305: R19.2 18.15,2.7 v18.5,2.7
N$34
  Top 0.254: 7.1,34.65 R29.2 8.4,35.85 LED3.C
N$37
  Top 0.254: IC1.41 17.35,4 17.35,3.2 LED4.A
NRST  (via drill 0.3, 0.4)
  Top 0.254: IC1.7 22.45,8.55 v22.6,8.4 | SW1.3 SW1.4 36.59,6.5 v36.6,6.5
  Bottom 0.254: v22.6,8.4 22.88,8.12 C34.1 23.3,7.9 23.83,7.37 24.76,7.37 25.1,7.71 25.1,8.7 25.43,9.03 35.87,9.03 36.4,8.5 | 37.92,8.97 CN6.5 37,9.1 36.4,8.5 | 36.4,8.5 36.4,6.7 v36.6,6.5
OC_COMP
  Top 0.254: IC1.24 15.35,13.1 R21.1 R14.1 C17.1
OP_P  (via drill 0.35)
  Top 0.254: R14.2 14.12,15.18 v14.1,15.2 14.9,16 14.9,16.8 15.15,17.05 R22.2
  Bottom 0.254: C6.2 7,16.5 5.8,17.7 5.8,18.3 Q2.1 Q2.2 | 10.45,15.21 10.44,15.2 | 4.3,33.4 R13.2 4.8,33.11 4.8,34.6 4.5,34.9 3.7,34.9 1.9,33.1 1.9,17.9 4.6,15.2 10.44,15.2 | 10.44,15.2 v14.1,15.2
  Bottom 0.3: Q6.3 Q6.2 Q6.1 5.78,28.73 | C5.2 6.8,27.7 5.78,28.73 | 5.78,28.73 4.9,27.85 4.9,25.6 5.28,25.23 Q4.3 Q4.2 Q4.1 5.78,23.23 5.8,23.2 | C4.2 6.9,22.1 5.8,23.2 | Q2.2 Q2.3 5.63,19.77 5.25,19.77 5.07,19.95 5.07,22.57 5.8,23.2
  pour Bottom (no thermals): 6.2,18.1 6.2,20.5 6.9,21.2 7.4,21.2 7.4,22.95 6.65,22.95 6.2,23.4 6.2,26.1 6.9,26.8 7.4,26.8 7.4,28.55 6.65,28.55 6.2,29 6.2,32.8 4.6,34.4 3.9,34.4 2.4,32.9 2.4,18.1 4.85,15.65 7.4,15.65 7.4,17.35 6.85,17.35
RTS  (via drill 0.3, 0.4)
  Top 0.254: IC1.19 17.85,11 v18,10.85 | v23.5,11.9 24,12.4 25.5,12.4 v26,12.9 | IC4.3 39.34,12.87 v39.3,12.9 38.4,12.9 38.06,12.56 IC4.2
  Bottom 0.254: v18,10.85 18,11.5 18.4,11.9 v23.5,11.9 | v26,12.9 36.23,12.9 37.01,13.68 38.92,13.68 39.3,13.3 v39.3,12.9
SWCLK  (via drill 0.4)
  Top 0.254: IC1.38 15.85,2.35 17.1,1.11 33.41,1.11 39.4,7.1 v39.8,7.1
  Bottom 0.254: CN6.2 38.8,12.1 39.8,11.1 39.8,9.4 v39.8,7.1
SWDIO  (via drill 0.4)
  Top 0.254: IC1.37 15.35,2.28 16.93,0.7 33.9,0.7 v34.1,0.9
  Bottom 0.254: CN6.4 38.8,10.1 39.1,9.8 39.1,5.9 v34.1,0.9
UART_RX  (via drill 0.4)
  Top 0.254: IC1.39 16.35,2.43 17.27,1.51 33.24,1.51 41.3,9.57 41.3,12.63 v40.8,13.13 40.4,13.53 37.73,13.53 36.8,12.6 IC4.1
  Bottom 0.254: CN5.3 38.8,18.4 40,17.2 40,13.93 v40.8,13.13
UART_TX  (via drill 0.4)
  Top 0.254: IC1.40 16.85,2.5 17.44,1.92 33.07,1.92 40.5,9.35 v40.5,9.7 40.6,9.8 IC4.4
  Bottom 0.254: CN5.4 38.8,17.4 39.33,16.87 39.33,13.94 39.93,13.34 39.93,11.87 40.21,11.59 40.21,9.99 v40.5,9.7

### Text on the board
tPlace: Batt | Motor | Scramble / BLDC_MotorDriver / for Maxon EC-Flat / v1.2 | Battery | RS485 | Hall | 5V | + | - | RESET | 3.3V
bPlace: UART | SWD